# EAGLE design 3. (EAGLE 9.6.2)
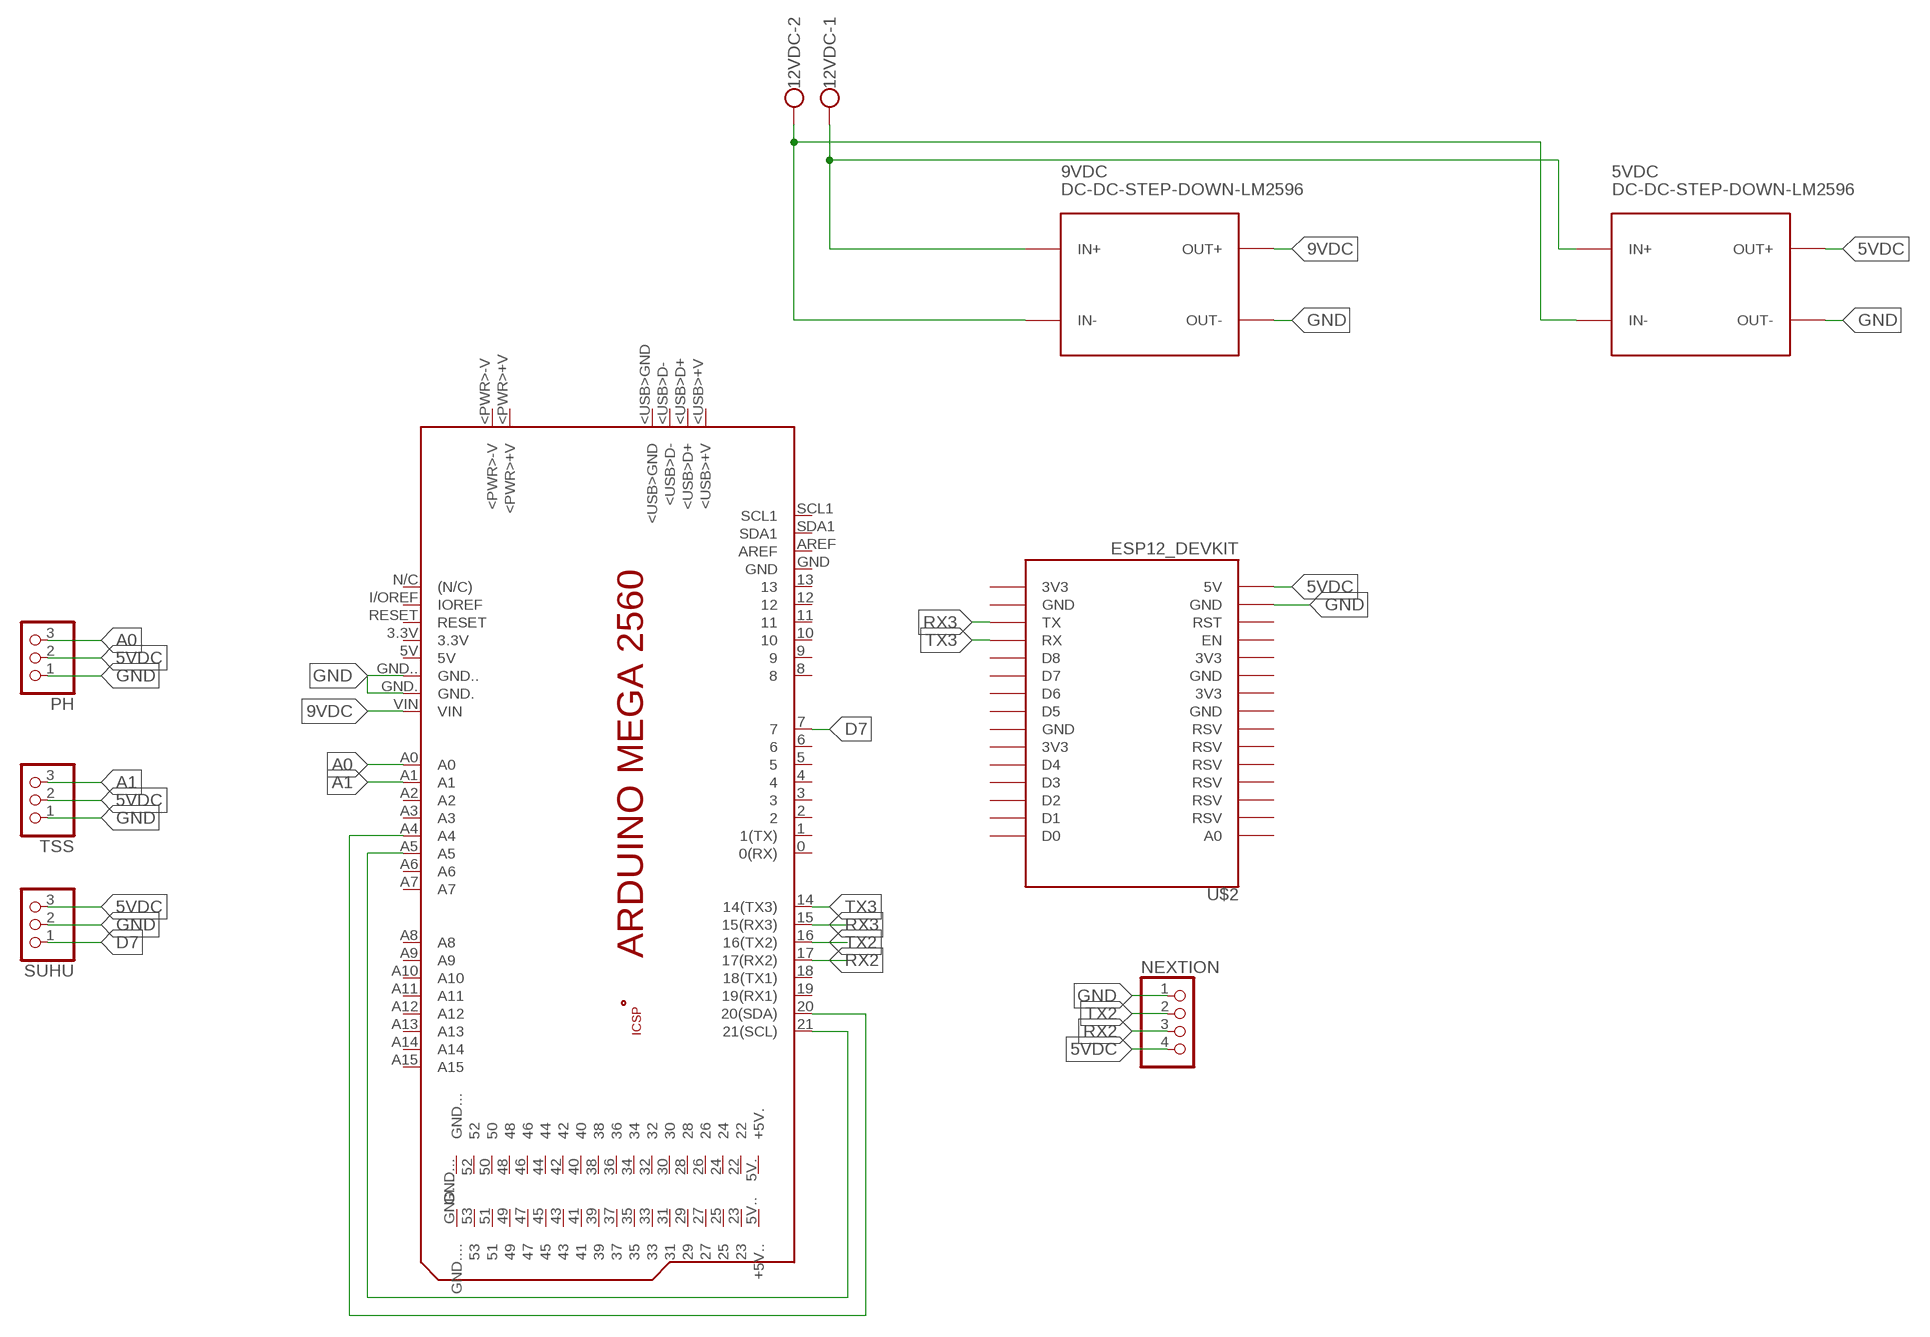
[diagram p0: schematic, sheet 1]

## Parts
5VDC  DC-DC-STEP-DOWN-LM2596  [DC-DC-STEP-DOWN-LM2596]
9VDC  DC-DC-STEP-DOWN-LM2596  [DC-DC-STEP-DOWN-LM2596]
12VDC  W237-102  [W237-102]
NEXTION  PINHD-1X4  [1X04]
PCB1  ARDUINO_MEGA2560  [ARDUINO_MEGA2560]
PH  PINHD-1X3  [1X03]
SUHU  PINHD-1X3  [1X03]
TSS  PINHD-1X3  [1X03]
U$2  ESP12_DEVKIT  [ESP12_DEVKIT]

## Nets
5VDC: 5VDC.OUT+ NEXTION.4 PH.2 SUHU.3 TSS.2 U$2.5V
9VDC: 9VDC.OUT+ PCB1.VIN
A0: PCB1.A0 PH.3
A1: PCB1.A1 TSS.3
D7: PCB1.7 SUHU.1
GND: 5VDC.OUT- 9VDC.OUT- NEXTION.1 PCB1.GND. PCB1.GND.. PH.1 SUHU.2 TSS.1 U$2.GND@1(GND)
N$1: 5VDC.IN+ 9VDC.IN+ 12VDC.1
N$2: 5VDC.IN- 9VDC.IN- 12VDC.2
N$15: PCB1.20(20(SDA)) PCB1.A4
N$17: PCB1.21(21(SCL)) PCB1.A5
RX2: NEXTION.3 PCB1.17(17(RX2))
RX3: PCB1.15(15(RX3)) U$2.TX
TX2: NEXTION.2 PCB1.16(16(TX2))
TX3: PCB1.14(14(TX3)) U$2.RX
Unconnected: PCB1.0(0(RX)) PCB1.1(1(TX)) PCB1.2 PCB1.3 PCB1.3.3V PCB1.4 PCB1.5 PCB1.5V PCB1.5V.(+5V.) PCB1.5V..(+5V..) PCB1.6 PCB1.8 PCB1.9 PCB1.10 PCB1.11 PCB1.12 PCB1.13 PCB1.18(18(TX1)) PCB1.19(19(RX1)) PCB1.22 PCB1.23 PCB1.24 PCB1.25 PCB1.26 PCB1.27 PCB1.28 PCB1.29 PCB1.30 PCB1.31 PCB1.32 PCB1.33 PCB1.34 PCB1.35 PCB1.36 PCB1.37 PCB1.38 PCB1.39 PCB1.40 PCB1.41 PCB1.42 PCB1.43 PCB1.44 PCB1.45 PCB1.46 PCB1.47 PCB1.48 PCB1.49 PCB1.50 PCB1.51 PCB1.52 PCB1.53 PCB1.+5V_ PCB1.<PWR>+V PCB1.<PWR>-V PCB1.<USB>+V PCB1.<USB>D+ PCB1.<USB>D- PCB1.<USB>GND PCB1.A2 PCB1.A3 PCB1.A6 PCB1.A7 PCB1.A8 PCB1.A9 PCB1.A10 PCB1.A11 PCB1.A12 PCB1.A13 PCB1.A14 PCB1.A15 PCB1.AREF PCB1.GND PCB1.GND... PCB1.GND.... PCB1.GND__ PCB1.I/OREF(IOREF) PCB1.MISO PCB1.MOSI PCB1.N/C((N/C)) PCB1.RESET PCB1.RESET. PCB1.SCK PCB1.SCL1 PCB1.SDA1 U$2.3V3@0(3V3) U$2.3V3@1(3V3) U$2.3V3@2(3V3) U$2.3V3@3(3V3) U$2.A0 U$2.D0 U$2.D1 U$2.D2 U$2.D3 U$2.D4 U$2.D5 U$2.D6 U$2.D7 U$2.D8 U$2.EN U$2.GND@0(GND) U$2.GND@2(GND) U$2.GND@3(GND) U$2.GND@4(GND) U$2.RST U$2.RSV@0(RSV) U$2.RSV@1(RSV) U$2.RSV@2(RSV) U$2.RSV@3(RSV) U$2.RSV@4(RSV) U$2.RSV@5(RSV)

## Library data of the parts
5VDC 9VDC = diy-modules:DC-DC-STEP-DOWN-LM2596: DC/DC Step-Down Regulator based on LM2596-ADJ chip LM2596 datasheet available here: http://www.ti.com/lit/ds/symlink/lm2596.pdf Click here to find device on ebay.com <http://www.ebay.com/sch/lm2596+power+regulator>
12VDC = con-wago-500:W237-102: WAGO SCREW CLAMP; MPN: 237-102; OC_FARNELL: unknown; OC_NEWARK: 70K9898
NEXTION = pinhead:PINHD-1X4: PIN HEADER
PCB1 = E14_Arduino_revC:ARDUINO_MEGA2560: Device for representing an Arduino Mega 2560 board with a footprint in an EAGLE design. Created by Dave Young for Element14. More EAGLE documentation at: http://www.element14.com/community/community/knode/cadsoft_eagle
PH SUHU TSS = pinhead:PINHD-1X3: PIN HEADER
U$2 = ESP12_DEVKIT:ESP12_DEVKIT: ESP12 DEVKIT BOARD

## Board
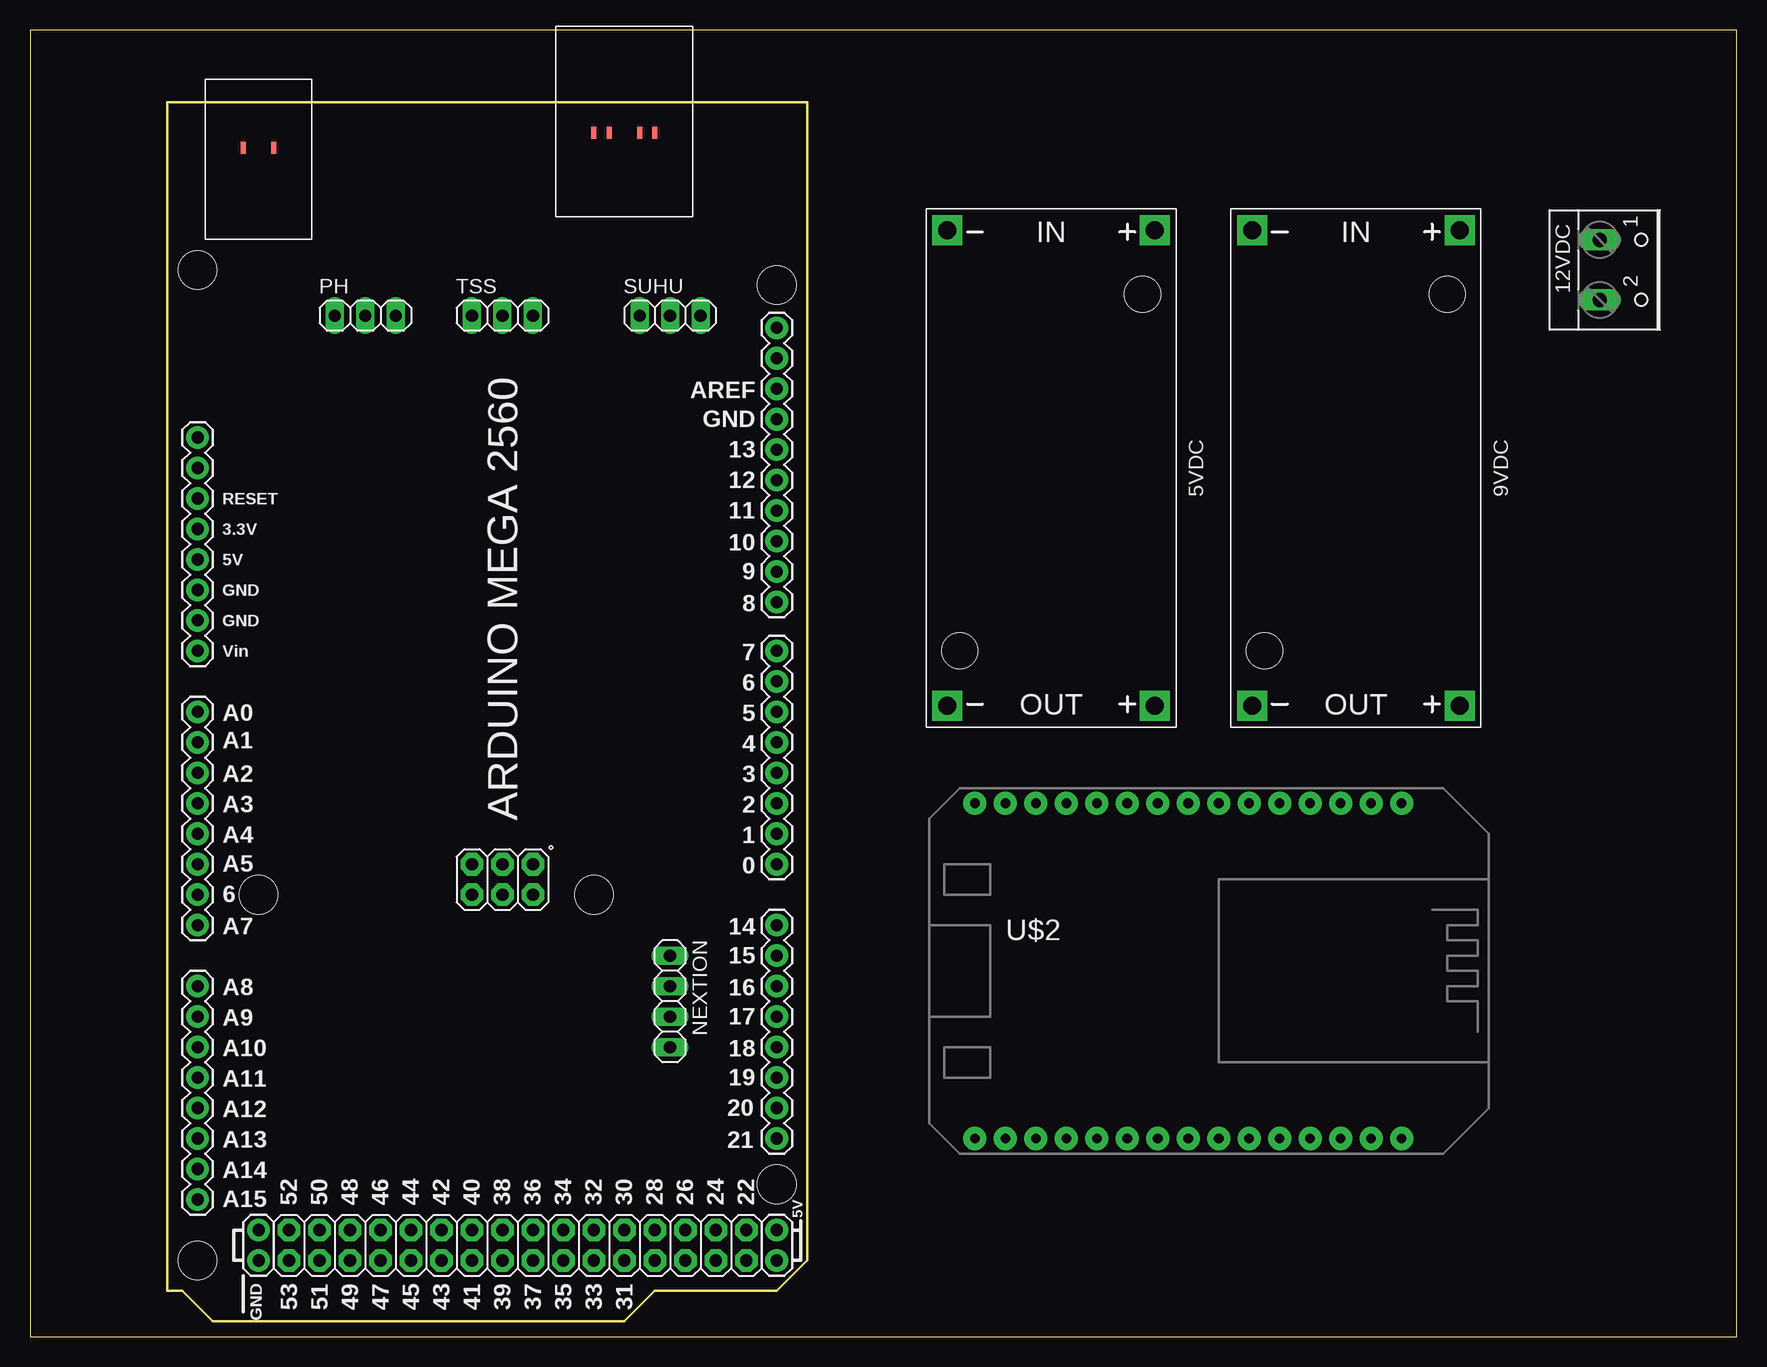
[diagram p1: board, top side]
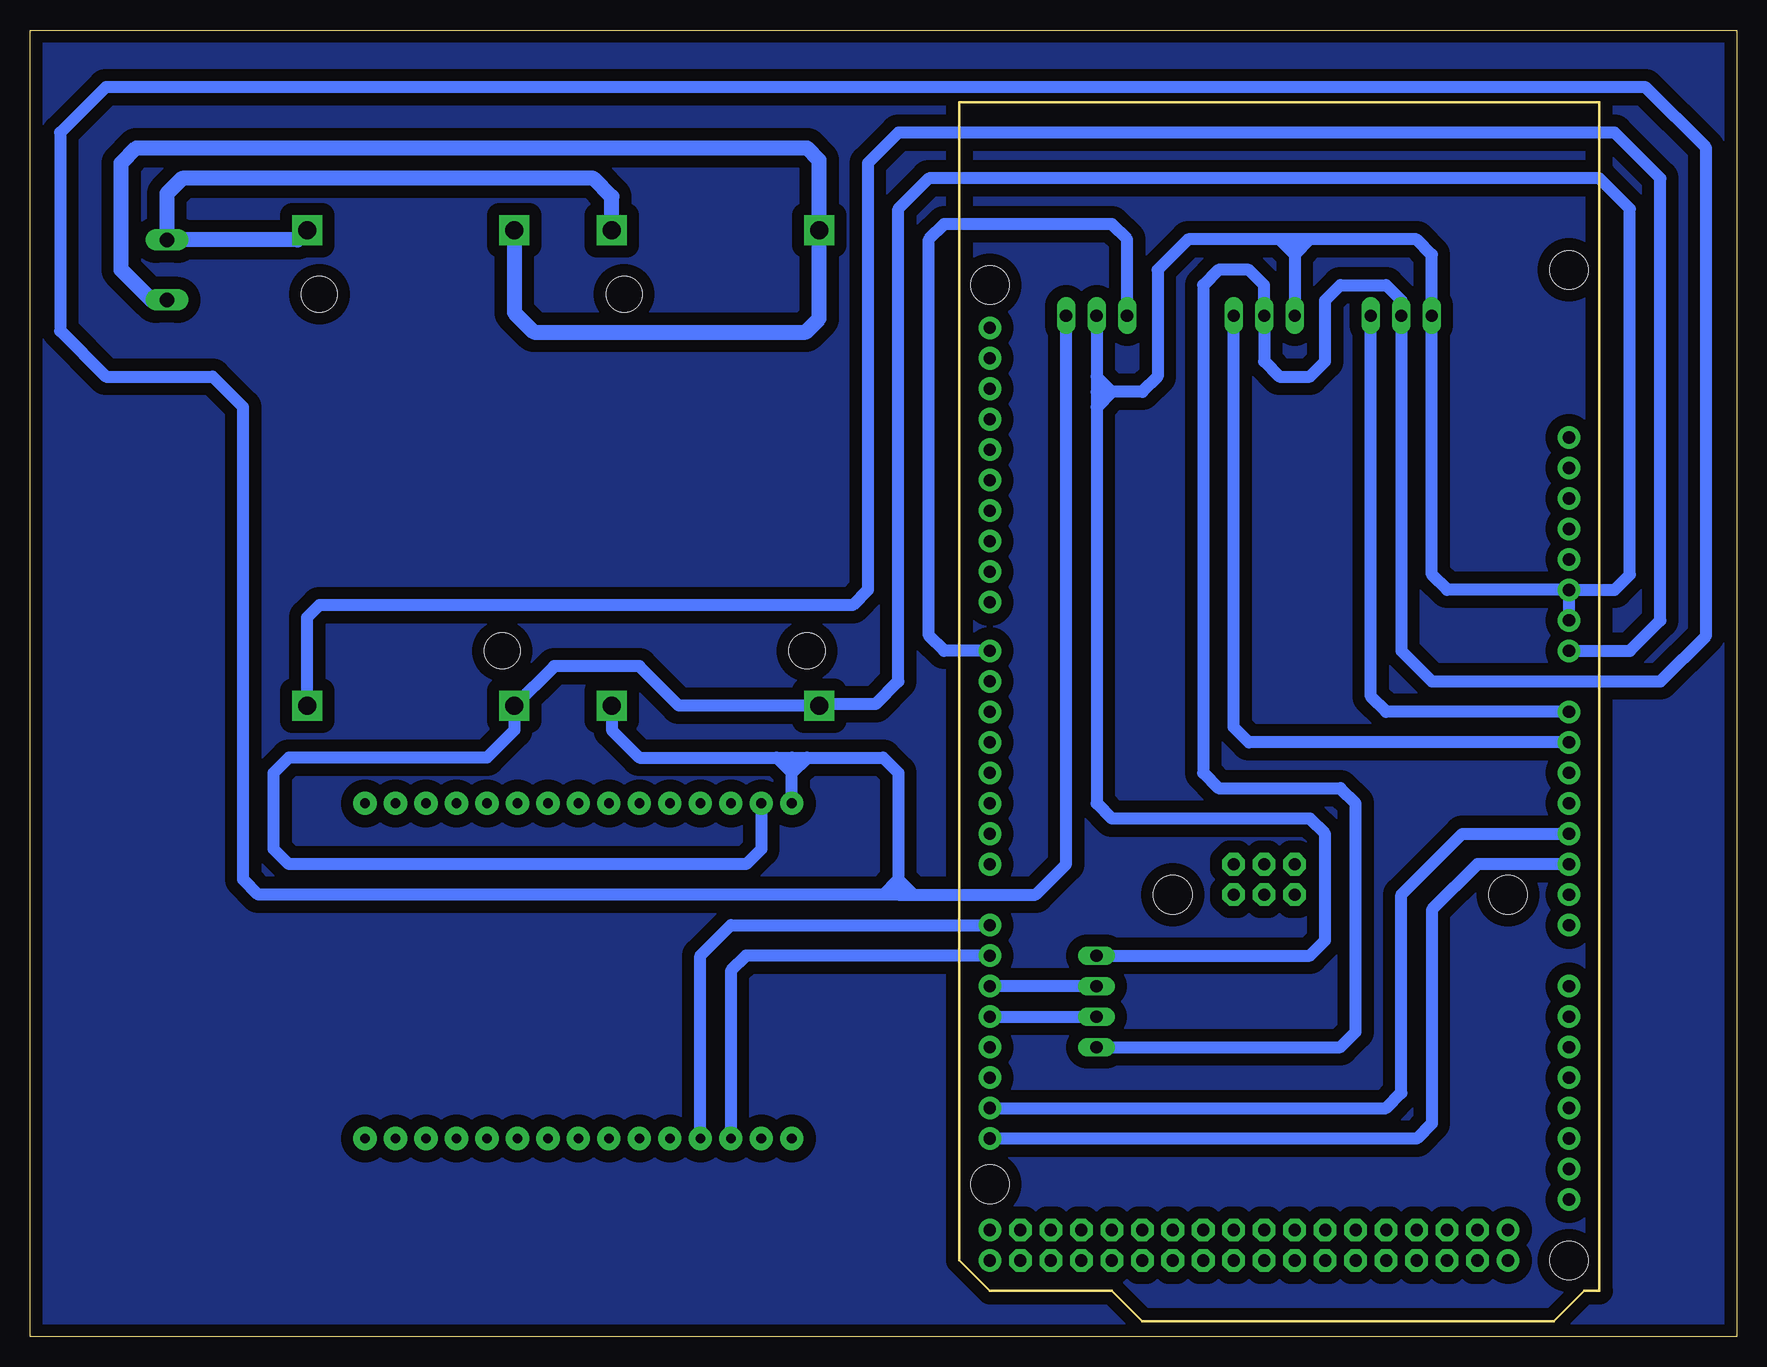
[diagram p2: board, bottom side, seen from below]

Size 142.22 x 108.89 mm. Coordinates in mm from the lower left corner, seen from the top.
Outline: 0,0 142.22,0 142.22,108.89 0,108.89 0,0
Copper layers (1*16): Top 0.035mm / dielectric 1.5mm / Bottom 0.035mm
Design rules "default *": minimum track width 6mil, minimum drill 0.35mm, track to track 40mil, track to pad 40mil, pad to pad 40mil, via to via 40mil, smd to smd 40mil, copper to edge 40mil, drill to drill 6mil, minimum pad ring 10mil, minimum via ring 8mil, stop-mask expansion 4mil, vias tented up to drill 0mil, thermal gap 10mil

### Footprints (pad centres in the part's own frame; a part is rotated, then mirrored left to right if it is on the bottom)
DC-DC-STEP-DOWN-LM2596 = drill 1.5 pad 2.5 square: IN+ -19.812,8.636; IN- -19.812,-8.636; OUT+ 19.812,8.636; OUT- 19.812,-8.636 | hole 3: -14.478,7.62; 15.24,-7.62
W237-102 = drill 1.194 long: 1 -2.5,-1.27; 2 2.5,-1.27
1X04 = drill 1.016 long: 1 -3.81,0; 2 -1.27,0; 3 1.27,0; 4 3.81,0
ARDUINO_MEGA2560 = drill 1.016 pad 1.88: 0 63.5,50.8; 1 60.96,50.8; 2 58.42,50.8; 3 55.88,50.8; 3.3V 35.56,2.54; 4 53.34,50.8; 5 50.8,50.8; 5V 38.1,2.54; 5V. 93.98,50.8; 5V.. 96.52,50.8; 6 48.26,50.8; 7 45.72,50.8; 8 41.656,50.8; 9 39.116,50.8; 10 36.576,50.8; 11 34.036,50.8; 12 31.496,50.8; 13 28.956,50.8; 14 68.58,50.8; 15 71.12,50.8; 16 73.66,50.8; 17 76.2,50.8; 18 78.74,50.8; 19 81.28,50.8; 20 83.82,50.8; 21 86.36,50.8; A0 50.8,2.54; A1 53.34,2.54; A2 55.88,2.54; A3 58.42,2.54; A4 60.96,2.54; A5 63.5,2.54; A6 66.04,2.54; A7 68.58,2.54; A8 73.66,2.54; A9 76.2,2.54; A10 78.74,2.54; A11 81.28,2.54; A12 83.82,2.54; A13 86.36,2.54; A14 88.9,2.54; A15 91.44,2.54; AREF 23.876,50.8; GND 26.416,50.8; GND. 43.18,2.54; GND.. 40.64,2.54; GND... 93.98,7.62; GND.... 96.52,7.62; I/OREF 30.48,2.54; N/C 27.94,2.54; RESET 33.02,2.54; SCL1 18.796,50.8; SDA1 21.336,50.8; VIN 45.72,2.54 | drill 1.016 pad 1.88 octagon: 22 93.98,48.26; 23 96.52,48.26; 24 93.98,45.72; 25 96.52,45.72; 26 93.98,43.18; 27 96.52,43.18; 28 93.98,40.64; 29 96.52,40.64; 30 93.98,38.1; 31 96.52,38.1; 32 93.98,35.56; 33 96.52,35.56; 34 93.98,33.02; 35 96.52,33.02; 36 93.98,30.48; 37 96.52,30.48; 38 93.98,27.94; 39 96.52,27.94; 40 93.98,25.4; 41 96.52,25.4; 42 93.98,22.86; 43 96.52,22.86; 44 93.98,20.32; 45 96.52,20.32; 46 93.98,17.78; 47 96.52,17.78; 48 93.98,15.24; 49 96.52,15.24; 50 93.98,12.7; 51 96.52,12.7; 52 93.98,10.16; 53 96.52,10.16; +5V_ 66.04,30.48; GND__ 66.04,25.4; MISO 63.5,30.48; MOSI 66.04,27.94; RESET. 63.5,25.4; SCK 63.5,27.94 | smd 1.016 x 0.508: <PWR>+V 3.81,8.89; <PWR>-V 3.81,6.35; <USB>+V 2.54,40.64; <USB>D+ 2.54,39.37; <USB>D- 2.54,36.83; <USB>GND 2.54,35.56 | hole 3.2: 15.24,50.8; 13.97,2.54; 66.04,35.56; 66.04,7.62; 90.17,50.8; 96.52,2.54
1X03 = drill 1.016 long: 1 -2.54,0; 2 0,0; 3 2.54,0
ESP12_DEVKIT = drill 0.8 pad 1.93: 3V3@0 -13.97,-7.62; 3V3@1 13.97,5.08; 3V3@2 13.97,-17.78; 3V3@3 -13.97,-2.54; 5V -13.97,-17.78; A0 -13.97,17.78; D0 13.97,17.78; D1 13.97,15.24; D2 13.97,12.7; D3 13.97,10.16; D4 13.97,7.62; D5 13.97,0; D6 13.97,-2.54; D7 13.97,-5.08; D8 13.97,-7.62; EN -13.97,-10.16; GND@0 -13.97,-5.08; GND@1 -13.97,-15.24; GND@2 13.97,2.54; GND@3 13.97,-15.24; GND@4 -13.97,0; RST -13.97,-12.7; RSV@0 -13.97,15.24; RSV@1 -13.97,12.7; RSV@2 -13.97,10.16; RSV@3 -13.97,7.62; RSV@4 -13.97,5.08; RSV@5 -13.97,2.54; RX 13.97,-10.16; TX 13.97,-12.7

### Placement (x,y rotation side)
5VDC  85.09,72.39 270 top
9VDC  110.49,72.39 270 top
12VDC  132.08,88.9 270 top
NEXTION  53.34,27.94 270 top
PCB1  11.43,102.87 270 top
PH  27.94,85.09 0 top
SUHU  53.34,85.09 0 top
TSS  39.37,85.09 0 top
U$2  96.52,30.48 270 top

### Tracks (layer width: path | path; a pad name or v marks a point on that pad's centre or on a via)
5VDC
  Bottom 1.016: 5VDC.OUT+ 93.73,50.55 91.44,48.26 80.01,48.26 | 80.01,48.26 78.74,48.26 | 78.74,48.26 77.47,48.26 | U$2.5V 78.74,46.99 | 78.74,46.99 78.74,48.26 | 78.74,46.99 77.47,48.26 | 78.74,46.99 80.01,48.26 | 69.85,36.83 68.58,36.83 | 69.85,36.83 71.12,36.83 | 71.12,36.83 123.19,36.83 124.46,38.1 124.46,77.47 127,80.01 135.89,80.01 139.7,83.82 139.7,100.33 135.89,104.14 7.62,104.14 2.54,99.06 2.54,58.42 6.35,54.61 25.4,54.61 27.94,57.15 PH.2 27.94,86.36 29.21,87.63 33.02,87.63 34.29,86.36 34.29,81.28 35.56,80.01 38.1,80.01 39.37,81.28 TSS.2 39.37,87.63 40.64,88.9 43.18,88.9 44.45,87.63 44.45,46.99 43.18,45.72 33.02,45.72 31.75,44.45 31.75,25.4 33.02,24.13 NEXTION.4 | 77.47,48.26 71.12,48.26 69.85,46.99 69.85,38.1 | 69.85,38.1 69.85,36.83 | 69.85,38.1 68.58,36.83 | 69.85,38.1 71.12,36.83 | 68.58,36.83 58.42,36.83 55.88,39.37 SUHU.3
9VDC
  Bottom 1.016: PCB1.VIN 8.89,57.15 6.35,59.69 6.35,96.52 10.16,100.33 69.85,100.33 72.39,97.79 72.39,62.23 73.66,60.96 118.11,60.96 119.13,59.94 9VDC.OUT+
A0
  Bottom 1.016: PH.3 30.48,53.34 29.21,52.07 PCB1.A0
A1
  Bottom 1.016: PCB1.A1 40.64,49.53 41.91,50.8 TSS.3
D7
  Bottom 1.016: PCB1.7 66.04,57.15 67.31,58.42 67.31,91.44 66.04,92.71 52.07,92.71 50.8,91.44 SUHU.1
GND
  Bottom 1.016: PCB1.GND. PCB1.GND.. | PCB1.GND.. 24.13,62.23 25.4,63.5 PH.1 25.4,90.17 26.67,91.44 35.56,91.44 | PCB1.GND.. 10.16,62.23 8.89,63.5 8.89,93.98 11.43,96.52 67.31,96.52 69.85,93.98 69.85,54.61 71.75,52.7 76.33,52.7 5VDC.OUT- 88.14,52.58 91.44,55.88 98.55,55.88 9VDC.OUT- 101.85,50.55 104.14,48.26 120.65,48.26 121.92,46.99 121.92,40.64 120.65,39.37 82.55,39.37 81.28,40.64 U$2.GND@1 | 36.83,91.44 36.83,90.17 | 36.83,90.17 TSS.1 | NEXTION.1 35.56,31.75 34.29,33.02 34.29,41.91 35.56,43.18 52.07,43.18 53.34,44.45 53.34,77.47 | SUHU.2 53.34,80.01 | 53.34,80.01 53.34,78.74 | 53.34,78.74 53.34,77.47 | 35.56,91.44 38.1,91.44 | 38.1,91.44 45.72,91.44 48.26,88.9 48.26,80.01 49.53,78.74 52.07,78.74 | 52.07,78.74 53.34,78.74 | 36.83,90.17 35.56,91.44 | 36.83,90.17 38.1,91.44 | 52.07,78.74 53.34,80.01 | 52.07,78.74 53.34,77.47
N$1
  Bottom 1.27: 5VDC.IN+ 93.73,95 95.25,96.52 129.54,96.52 130.81,95.25 12VDC.1 119.93,91.4 9VDC.IN+
N$2
  Bottom 1.27: 12VDC.2 132.12,86.4 134.62,88.9 134.62,97.79 133.35,99.06 77.47,99.06 76.45,98.04 5VDC.IN- 76.45,84.84 77.57,83.72 100.23,83.72 101.85,85.34 9VDC.IN-
N$15
  Bottom 1.016: PCB1.A4 22.86,41.91 27.94,36.83 27.94,20.32 29.21,19.05 PCB1.20
N$17
  Bottom 1.016: PCB1.A5 21.59,39.37 25.4,35.56 25.4,17.78 26.67,16.51 PCB1.21
RX2
  Bottom 1.016: PCB1.17 NEXTION.3
RX3
  Bottom 1.016: PCB1.15 82.55,31.75 83.82,30.48 U$2.TX
TX2
  Bottom 1.016: NEXTION.2 PCB1.16
TX3
  Bottom 1.016: U$2.RX 86.36,31.75 83.82,34.29 PCB1.14
Z
  pour Bottom: 1.27,109.22 142.24,109.22 142.24,101.6 142.24,0 0,0 0,109.22